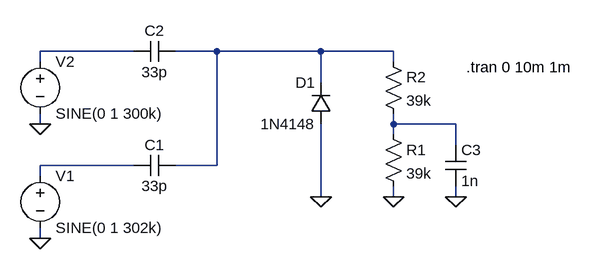
[diagram p0: schematic heterodyning.asc]
heterodyning.asc, the LTspice schematic file:
Version 4
SHEET 1 880 680
WIRE -80 176 -224 176
WIRE 48 176 -16 176
WIRE 208 176 48 176
WIRE 320 176 208 176
WIRE -224 192 -224 176
WIRE 320 192 320 176
WIRE 208 224 208 176
WIRE -224 288 -224 272
WIRE 320 288 320 272
WIRE 416 288 320 288
WIRE 320 304 320 288
WIRE 416 320 416 288
WIRE -80 352 -224 352
WIRE 48 352 48 176
WIRE 48 352 -16 352
WIRE -224 368 -224 352
WIRE 208 400 208 288
WIRE 320 400 320 384
WIRE 416 400 416 384
WIRE -224 464 -224 448
FLAG -224 288 0
FLAG -224 464 0
FLAG 320 400 0
FLAG 208 400 0
FLAG 416 400 0
SYMBOL Voltage -224 352 R0
SYMATTR InstName V1
SYMATTR Value SINE(0 1 302k)
SYMBOL Voltage -224 176 R0
SYMATTR InstName V2
SYMATTR Value SINE(0 1 300k)
SYMBOL Cap -16 336 R90
WINDOW 0 0 32 VBottom 2
WINDOW 3 32 32 VTop 2
SYMATTR InstName C1
SYMATTR Value 33p
SYMBOL Cap -16 160 R90
WINDOW 0 0 32 VBottom 2
WINDOW 3 32 32 VTop 2
SYMATTR InstName C2
SYMATTR Value 33p
SYMBOL diode 224 288 R180
WINDOW 0 24 64 Left 2
WINDOW 3 24 0 Left 2
SYMATTR InstName D1
SYMATTR Value 1N4148
SYMBOL Res 304 288 R0
SYMATTR InstName R1
SYMATTR Value 39k
SYMBOL Res 304 176 R0
SYMATTR InstName R2
SYMATTR Value 39k
SYMBOL Cap 400 320 R0
SYMATTR InstName C3
SYMATTR Value 1n
TEXT 432 200 Left 2 !.tran 0 10m 1m

The netlist it stands for:
* heterodyning.asc
V1 N004 0 SINE(0 1 302k)
V2 N001 0 SINE(0 1 300k)
C1 N002 N004 33p
C2 N002 N001 33p
D1 0 N002 1N4148
R1 N003 0 39k
R2 N002 N003 39k
C3 N003 0 1n
.model D D
.lib standard.dio
.tran 0 10m 1m
.backanno
.end